# Altium schematic sheet sch_2022-04-21.schdoc
size 297 x 254 mm
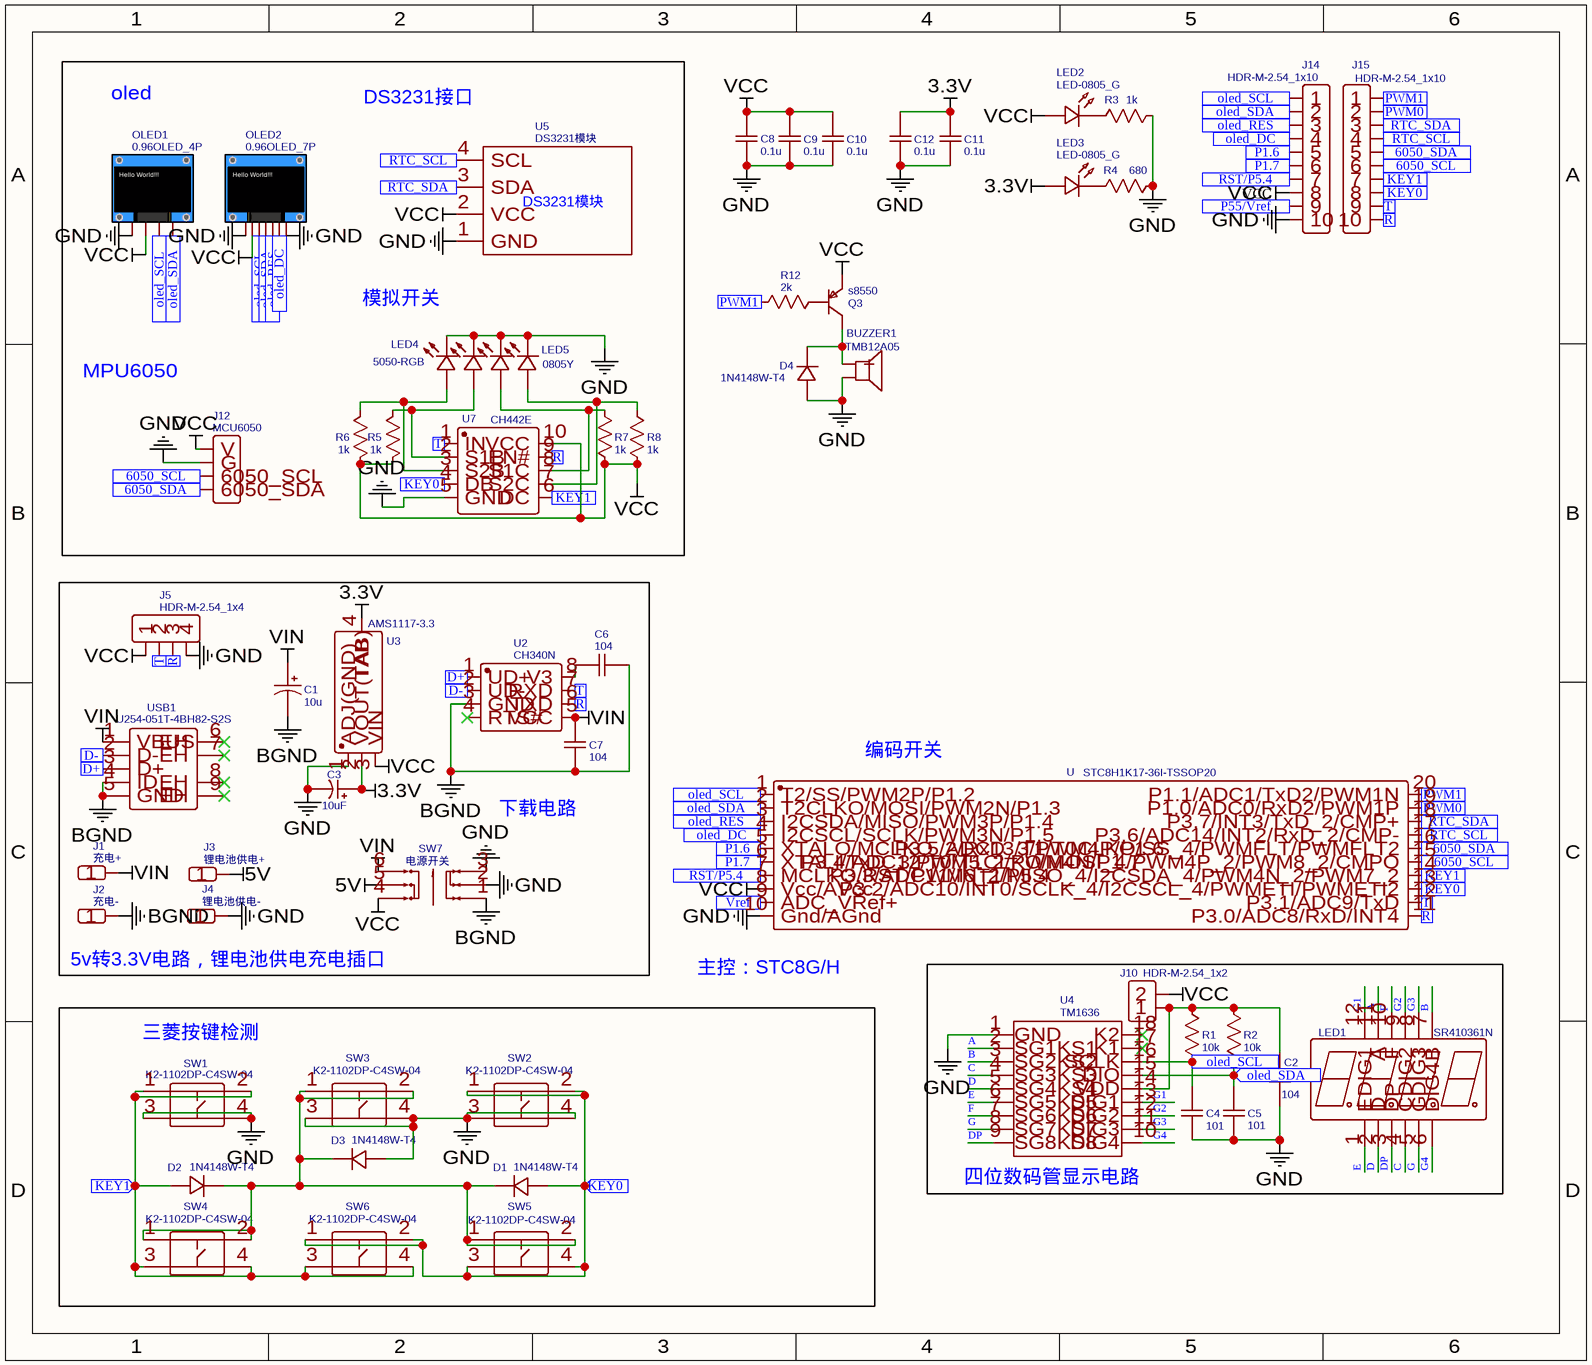
[diagram p0: sch_2022-04-21.schdoc]

## Parts
BUZZER1  TMB12A05  [BUZ-TH_BD12.0-P7.60-D0.6-FD]
C1  10u  [CAP-D4.0×F1.5]
C2  104  [C0805]
C3  10uF  [CAP-SMD_L3.2-W1.6]
C4  101  [C0603]
C5  101  [C0603]
C6  104  [C0805]
C7  104  [C0805]
C8  0.1u  [C0805]
C9  0.1u  [C0805]
C10  0.1u  [C0805]
C11  0.1u  [C0805]
C12  0.1u  [C0805]
D1  1N4148W-T4  [SOD-123_L2.8-W1.8-LS3.7-RD]
D2  1N4148W-T4  [SOD-123_L2.8-W1.8-LS3.7-RD]
D3  1N4148W-T4  [SOD-123_L2.8-W1.8-LS3.7-RD]
D4  1N4148W-T4  [SOD-123_L2.8-W1.8-LS3.7-RD]
J1  充电+  [HDR-M-2.54_1X1]
J2  充电-  [HDR-M-2.54_1X1]
J3  锂电池供电+  [HDR-M-2.54_1X1]
J4  锂电池供电-  [HDR-M-2.54_1X1]
J5  HDR-M-2.54_1x4  [HDR-M-2.54_1X4]
J10  HDR-M-2.54_1x2  [HDR-M-2.54_1X2]
J12  MCU6050  [HDR-M-2.54_1X4]
J14  HDR-M-2.54_1x10  [HDR-M-2.54_1X10]
J15  HDR-M-2.54_1x10  [HDR-M-2.54_1X10]
LED1  SR410361N  [LED-SEG-TH_12P-L30.0-W14.0-P2.54-S10.26-BL]
LED2  LED-0805_G  [LED0805_GREEN]
LED3  LED-0805_G  [LED0805_GREEN]
LED4  5050-RGB  [LED-ARRAY-SMD_6P-L5.4-W5.0-TL-FD]
LED5  0805Y  [LED0805-RD_YELLOW]
OLED1  0.96OLED_4P  [0.96OLED_4P]
OLED2  0.96OLED_7P  [0.96OLED_7P]
Q3  s8550  [SOT-23-3_L2.9-W1.6-P1.90-LS2.8-TR-CW]
R1  10k  [R0603]
R2  10k  [R0603]
R3  1k  [R0805]
R4  680  [R0805]
R5  1k  [R0805]
R6  1k  [R0805]
R7  1k  [R0805]
R8  1k  [R0805]
R12  2k  [R0805]
SW1  K2-1102DP-C4SW-04  [KEY-TH_4P-L6.0-W6.0-P4.50-LS6.5]
SW2  K2-1102DP-C4SW-04  [KEY-TH_4P-L6.0-W6.0-P4.50-LS6.5]
SW3  K2-1102DP-C4SW-04  [KEY-TH_4P-L6.0-W6.0-P4.50-LS6.5]
SW4  K2-1102DP-C4SW-04  [KEY-TH_4P-L6.0-W6.0-P4.50-LS6.5]
SW5  K2-1102DP-C4SW-04  [KEY-TH_4P-L6.0-W6.0-P4.50-LS6.5]
SW6  K2-1102DP-C4SW-04  [KEY-TH_4P-L6.0-W6.0-P4.50-LS6.5]
SW7  电源开关  [SW-TH_6P-L8.0-W8.0-P2.50]
U  STC8H1K17-36I-TSSOP20  [TSSOP-20_L6.5-W4.4-P0.65-LS6.4-BL]
U2  CH340N  [SOP-8_L5.0-W4.0-P1.27-LS6.0-BL]
U3  AMS1117-3.3  [SOT-223-4_L6.5-W3.5-P2.30-LS7.0-BR]
U4  TM1636  [DIP18-2.54-22.8X7.62MM]
U5  DS3231模块  [DS3231模块]
U7  CH442E  [MSOP-10_L3.0-W3.0-P0.50-LS5.0-BL]
USB1  U254-051T-4BH82-S2S  [MICRO-USB-SMD_U254-051T-4BH82-S2S]

## Blocks framed on the sheet
三菱按键检测: D1-D3 SW1-SW6
四位数码管显示电路: C2 C4 C5 J10 LED1 R1 R2 U4

## Ports
6050_SCL (in), 6050_SDA (in), D+ (in), D- (in), KEY0 (in), KEY1 (in), oled_DC (in), oled_RES (in), oled_SCL (in), oled_SDA (in), P1.6 (in), P1.7 (in), P55/Vref (in), PWM0 (in), PWM1 (in), R (in), RST/P5.4 (in), RTC_SCL (in), RTC_SDA (in), T (in), Vref (in)

## Nets
3.3V: C3.1 C11.2 C12.2 LED3.1 U3.2(VOUT(TAB)) U3.4(TAB)
5V: J3.1 SW7.5
BGND: C1.2 C6.2 C7.1 J2.1 SW7.1 U2.3(GND) USB1.4(ID) USB1.5(GND)
GND: BUZZER1.2 C2.1 C3.2 C4.2 C5.1 C8.1 C9.1 C10.1 C11.1 C12.1 D3.2(A) D4.2(A) J4.1 J5.4 J12.2(G) J14.10 LED4.4(C) LED4.5(C) LED4.6(C) LED5.1(-) OLED1.1 OLED2.1 OLED2.7 R3.2 R4.2 SW1.3 SW1.4 SW2.3 SW2.4 SW3.3 SW3.4 SW7.2 SW7.3 U.10(Gnd/AGnd) U3.1(ADJ(GND)) U4.1(GND) U5.1(GND) U7.5(GND)
VCC: C8.2 C9.2 C10.2 J5.1 J10.2 J12.1(V) J14.8 LED2.1 OLED1.2 OLED2.2 Q3.1(E) R5.1 R6.2 R7.2 R8.2 SW7.4 U.8(Vcc/AVcc) U3.3(VIN) U5.2(VCC) U7.10(VCC)
VIN: C1.1 C7.2 J1.1 SW7.6 U2.5(VCC) USB1.1(VBUS)
6050_SCL: J12.3(6050_SCL) J15.6 U.15(P3.4/ADC12/T0/T1CLKO/MOSI_4/PWM4P_2/PWM8_2/CMPO) ; port 6050_SCL
6050_SDA: J12.4(6050_SDA) J15.5 U.16(P3.5/ADC13/T1/T0CLKO/SS_4/PWMFLT/PWMFLT2) ; port 6050_SDA
A: LED1.11(A) U4.2(SG1KS1)
B: LED1.7(B) U4.3(SG2KS2)
C: LED1.4(C) U4.4(SG3KS3)
D: LED1.2(D) U4.5(SG4KS4)
D+: U2.1(UD+) USB1.3(D+) ; port D+
D-: U2.2(UD-) USB1.2(D-) ; port D-
DP: LED1.3(DP) U4.9(SG8KS8)
E: LED1.1(E) U4.6(SG5KS5)
F: LED1.10(F) U4.7(SG6KS6)
G: LED1.5(G) U4.8(SG7KS7)
G1: LED1.12(DIG1) U4.13(DIG1)
G2: LED1.9(DIG2) U4.12(DIG2)
G3: LED1.8(DIG3) U4.11(DIG3)
G4: LED1.6(DIG4) U4.10(DIG4)
KEY0: D1.2(A) J15.8 SW2.1 SW2.2 SW5.3 SW5.4 SW6.1 SW6.2 U.13(P3.2/ADC10/INT0/SCLK_4/I2CSCL_4/PWMETI/PWMETI2) U7.4(DB) ; port KEY0
KEY1: D2.2(A) J15.7 SW1.1 SW1.2 SW4.3 SW4.4 SW6.3 SW6.4 U.14(P3.3/ADC11/INT1/MISO_4/I2CSDA_4/PWM4N_2/PWM7_2) U7.6(DC) ; port KEY1
oled_DC: J14.4 OLED2.6 U.4(I2CSCL/SCLK/PWM3N/P1.5) ; port oled_DC
oled_RES: J14.3 OLED2.5 U.3(I2CSDA/MISO/PWM3P/P1.4) ; port oled_RES
oled_SCL: C4.1 J14.1 OLED1.3 OLED2.3 R1.1 U.1(T2/SS/PWM2P/P1.2) U4.16(SCLK) ; port oled_SCL
oled_SDA: C5.2 J14.2 OLED1.4 OLED2.4 R2.1 U.2(T2CLKO/MOSI/PWM2N/P1.3) U4.15(DIO) ; port oled_SDA
P1.6: J14.5 U.5(XTALO/MCLKO_2/RxD_3/PWM4P/P1.6) ; port P1.6
P1.7: J14.6 U.6(XTALI/TxD_3/PWM5_2/PWM4N/P1.7) ; port P1.7
P55/Vref: J14.9 ; port P55/Vref
PWM0: J15.2 U.19(P1.0/ADC0/RxD2/PWM1P) ; port PWM0
PWM1: J15.1 R12.1 U.20(P1.1/ADC1/TxD2/PWM1N) ; port PWM1
R: J5.3 J15.10 U.11(P3.0/ADC8/RxD/INT4) U2.6(TXD) U7.9(EN#) ; port R
RST/P5.4: J14.7 U.7(MCLKO/RST/PWM6_2/P5.4) ; port RST/P5.4
RTC_SCL: J15.4 U.17(P3.6/ADC14/INT2/RxD_2/CMP-) U5.4(SCL) ; port RTC_SCL
RTC_SDA: J15.3 U.18(P3.7/INT3/TxD_2/CMP+) U5.3(SDA) ; port RTC_SDA
T: J5.2 J15.9 U.12(P3.1/ADC9/TxD) U2.7(RXD) U7.1(IN) ; port T
Vref: U.9(ADC_VRef+) ; port Vref
NetBUZZER1_1: BUZZER1.1(+) D4.1(C) Q3.3(C)
NetC2_2: C2.2 J10.1 R1.2 R2.2 U4.14(VDD)
NetC6_1: C6.1 U2.8(V3)
NetD1_1: D1.1(C) D2.1(C) D3.1(C) SW3.1 SW3.2 SW4.1 SW4.2 SW5.1 SW5.2
NetLED2_2: LED2.2 R3.1
NetLED3_2: LED3.2 R4.1
NetLED4_1: LED4.1(A) R6.1 U7.3(S2B)
NetLED4_2: LED4.2(A) R5.2 U7.2(S1B)
NetLED4_3: LED4.3(A) R7.1 U7.8(S1C)
NetLED5_2: LED5.2(+) R8.1 U7.7(S2C)
NetQ3_2: Q3.2(B) R12.2

Not connected (* = marked no-connect by the designer): U2 4(RTS#)*; U4 17(K1)* 18(K2)*; USB1 6(EH)* 7(EH)* 8(EH)* 9(EH)*

## Notes on the sheet
- oled
- DS3231接口
- (near J14) VCC
- 模拟开关
- MPU6050
- (near U) 编码开关
- 下载电路
- 5v转3.3V电路，锂电池供电充电插口
- (near U) 主控：STC8G/H
- (in symbol 0.96OLED_4P) Hello World!!!
- (in symbol 0.96OLED_7P) Hello World!!!

## Library data of the parts
BUZZER1 = TMB12A05: BOM_Manufacturer: HNDZ; BOM_Supplier: LCSC; BOM_Manufacturer Part: TMB12A05; BOM_Supplier Part: C96093; BOM_JLCPCB Part Class: Extended Part; spicePre: B; spiceSymbolName: TMB12A05
C1 = 10u: nameAlias: Value(F); Contributor: LCEDA_Lib; spicePre: C; spiceSymbolName: CE_TH_D4.0×F1.5_US
C2 C6 C7 = 104: nameAlias: Value(F); Contributor: LCEDA_Lib; spicePre: C; spiceSymbolName: C_0805_US
C3 = 10uF: BOM_Manufacturer: KEMET(基美); BOM_Manufacturer Part: T494A106M020AT; nameAlias: Capacitance; Contributor: LCSC; BOM_Supplier: LCSC; BOM_Supplier Part: C1954253; spicePre: C; spiceSymbolName: T494A106M020AT
C4 C5 = 101: nameAlias: Value(F); Contributor: LCEDA_Lib; spicePre: C; spiceSymbolName: C_0603_US
C8-C12 = 0.1u: nameAlias: Value(F); Contributor: LCEDA_Lib; spicePre: C; spiceSymbolName: C_0805_US
D1-D4 = 1N4148W-T4: BOM_Manufacturer: Guangdong Hottech; Contributor: LCSC; BOM_Supplier: LCSC; BOM_Supplier Part: C181134; BOM_Manufacturer Part: 1N4148W-T4; BOM_JLCPCB Part Class: Extended Part; spicePre: D; spiceSymbolName: 1N4148W-T4
J1 = 充电+: Contributor: LCEDA_Lib; BOM_Supplier Part: C81276; BOM_Supplier: LCSC; spicePre: J; spiceSymbolName: HDR-M-2.54_1x1
J2 = 充电-: Contributor: LCEDA_Lib; BOM_Supplier Part: C81276; BOM_Supplier: LCSC; spicePre: J; spiceSymbolName: HDR-M-2.54_1x1
J3 = 锂电池供电+: Contributor: LCEDA_Lib; BOM_Supplier Part: C81276; BOM_Supplier: LCSC; spicePre: J; spiceSymbolName: HDR-M-2.54_1x1
J4 = 锂电池供电-: Contributor: LCEDA_Lib; BOM_Supplier Part: C81276; BOM_Supplier: LCSC; spicePre: J; spiceSymbolName: HDR-M-2.54_1x1
J5 = HDR-M-2.54_1x4: Contributor: LCEDA_Lib; BOM_Supplier Part: C124378; BOM_Supplier: LCSC; spicePre: J; spiceSymbolName: HDR-M-2.54_1x4
J10 = HDR-M-2.54_1x2: Contributor: LCEDA_Lib; BOM_Supplier Part: C124375; BOM_Supplier: LCSC; spicePre: J; spiceSymbolName: HDR-M-2.54_1x2
J12 = MCU6050: Contributor: LCEDA_Lib; BOM_Supplier Part: C124378; BOM_Supplier: LCSC; spicePre: J; spiceSymbolName: HDR-M-2.54_1x4
J14 J15 = HDR-M-2.54_1x10: Contributor: LCEDA_Lib; BOM_Supplier Part: C57369; BOM_Supplier: LCSC; spicePre: J; spiceSymbolName: HDR-M-2.54_1x10
LED1 = SR410361N: BOM_Manufacturer: Wuxi ARK Tech Elec; Contributor: LCSC; BOM_Supplier: LCSC; BOM_Supplier Part: C132660; BOM_Manufacturer Part: SR410361N; BOM_JLCPCB Part Class: Extended Part; spicePre: L; spiceSymbolName: SR410361N
LED2 LED3 = LED-0805_G: BOM_Manufacturer: EVERLIGHT(台湾亿光); BOM_Manufacturer Part: 333-2SYGD/S530-E2; Contributor: LCEDA_Lib; BOM_Supplier Part: C88163; BOM_Supplier: LCSC; spicePre: L; spiceSymbolName: LED-TH-5mm_G
LED4 = 5050-RGB: BOM_Manufacturer: Hongli Zhihui (HONGLITRONIC); BOM_Manufacturer Part: HL-AF-5060H271BU46FU79GC-S1-THL; Contributor: LCSC; BOM_Supplier: LCSC; BOM_Supplier Part: C219409; BOM_JLCPCB Part Class: Extended Part; spicePre: L; spiceSymbolName: HL-AF-5060H271BU46FU79GC-S1-THL
LED5 = 0805Y: BOM_Manufacturer: Yongyu Photoelectric; BOM_Manufacturer Part: SZYY0805Y; Contributor: LCSC; BOM_Supplier: LCSC; BOM_Supplier Part: C434436; BOM_JLCPCB Part Class: Extended Part; spicePre: L; spiceSymbolName: SZYY0805Y
OLED1 = 0.96OLED_4P: Contributor: LCEDA_Lib; BOM_Supplier: LCSC; spicePre: O; spiceSymbolName: 0.96OLED_4P
OLED2 = 0.96OLED_7P: Contributor: LCEDA_Lib; BOM_Supplier: LCSC; spicePre: O; spiceSymbolName: 0.96OLED_7P
Q3 = s8550: BOM_Manufacturer: KEC; BOM_Manufacturer Part: 2N3906S-RTK/PS; Contributor: LCEDA_Lib; BOM_Supplier: LCSC; BOM_Supplier Part: C147294; spicePre: Q; spiceSymbolName: 2N3906(SOT-23)
R1 R2 = 10k: nameAlias: Value(Ω); Contributor: LCEDA_Lib; spicePre: R; spiceSymbolName: R_0603_US
R3 R5-R8 = 1k: nameAlias: Value(Ω); Contributor: LCEDA_Lib; spicePre: R; spiceSymbolName: R_0805_US
R4 = 680: nameAlias: Value(Ω); Contributor: LCEDA_Lib; spicePre: R; spiceSymbolName: R_0805_US
R12 = 2k: nameAlias: Value(Ω); Contributor: LCEDA_Lib; spicePre: R; spiceSymbolName: R_0805_US
SW1-SW6 = K2-1102DP-C4SW-04: BOM_Manufacturer: HRO; Contributor: LCSC; BOM_Supplier: LCSC; BOM_Manufacturer Part: K2-1102DP-C4SW-04; BOM_Supplier Part: C110153; BOM_JLCPCB Part Class: Extended Part; spicePre: S; spiceSymbolName: K2-1102DP-C4SW-04
SW7 = 电源开关: BOM_Manufacturer: XKB Enterprise; BOM_Manufacturer Part: XKB8080-Z; Contributor: LCSC; BOM_Supplier: LCSC; BOM_Supplier Part: C318860; BOM_JLCPCB Part Class: Extended Part; spicePre: S; spiceSymbolName: XKB8080-Z
U = STC8H1K17-36I-TSSOP20: BOM_Manufacturer: STC Micro; Contributor: LCSC; BOM_Supplier: LCSC; BOM_Supplier Part: C915675; BOM_Manufacturer Part: STC8H1K17-36I-TSSOP20; BOM_JLCPCB Part Class: Extended Part; spicePre: U; spiceSymbolName: STC8H1K17-36I-TSSOP20
U2 = CH340N: BOM_Manufacturer: WCH(Jiangsu Qin Heng); Contributor: LCSC; BOM_Supplier: LCSC; BOM_Supplier Part: C506813; BOM_Manufacturer Part: CH340N; BOM_JLCPCB Part Class: Extended Part; spicePre: U; spiceSymbolName: CH340N
U3 = AMS1117-3.3: BOM_Manufacturer: Youtai Semiconductor Co., Ltd.; Contributor: LCSC; BOM_Supplier: LCSC; BOM_Supplier Part: C347222; BOM_Manufacturer Part: AMS1117-3.3; BOM_JLCPCB Part Class: Extended Part; spicePre: U; spiceSymbolName: AMS1117-3.3_C347222
U4 = TM1636: description: DIP IC Driver;; sourceId: EwIigPpnz; timeStamp: 1448004853; BOM_Manufacturer Part: TM1636; spicePre: U; spiceSymbolName: TM1636
U5 = DS3231模块: Contributor: lipk888; spicePre: U; spiceSymbolName: DS3231模块
U7 = CH442E: BOM_Manufacturer: WCH; Contributor: LCSC; BOM_Supplier: LCSC; BOM_Manufacturer Part: CH442E; BOM_Supplier Part: C150097; BOM_JLCPCB Part Class: Extended Part; spicePre: U; spiceSymbolName: CH442E
USB1 = U254-051T-4BH82-S2S: BOM_Manufacturer: XKB Connectivity(中国星坤); Contributor: LCSC; BOM_Supplier: LCSC; BOM_Supplier Part: C908456; BOM_Manufacturer Part: U254-051T-4BH82-S2S; BOM_JLCPCB Part Class: Extended Part; spicePre: U; spiceSymbolName: U254-051T-4BH82-S2S